# EAGLE schematic bolek (EAGLE 9.2.1)

## Sheet 1 of 10: Communication
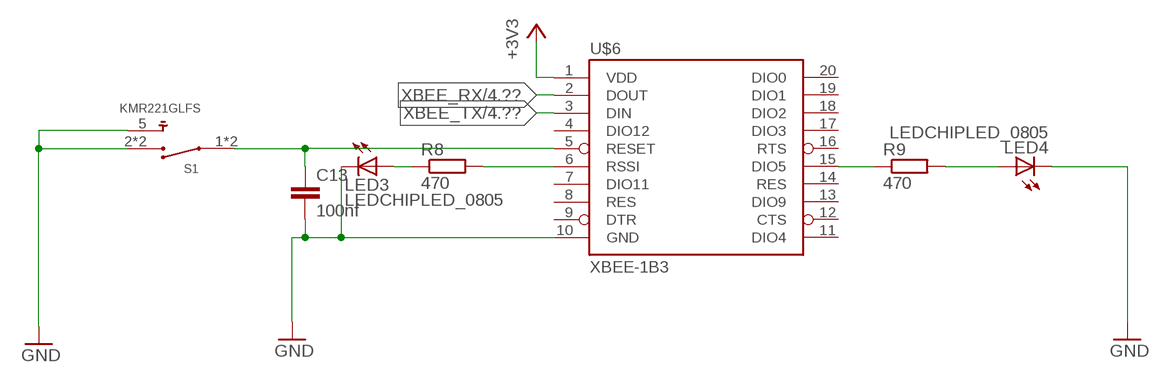
[diagram p0: schematic, sheet 1]

### Parts
C13  100nf  C-EUC0603  [C0603]
LED3  LEDCHIPLED_0805  [CHIPLED_0805]
LED4  LEDCHIPLED_0805  [CHIPLED_0805]
R8  470  R-EU_R0603  [R0603]
R9  470  R-EU_R0603  [R0603]
S1  KMR221GLFS  [SW_KMR221GLFS]
U$6  XBEE-1B3  [XBEE-SMD]

### Nets
+3V3: U$6.1(VDD) ; also sheet 2,3,4,5,6,7,8,9
GND: C13.2 LED3.C LED4.C S1.2 S1.3 S1.5 U$6.10(GND) ; also sheet 2,3,4,5,6,7,8,9
N$9: C13.1 S1.1 S1.4 U$6.5(RESET)
N$10: R8.2 U$6.6(RSSI)
N$11: LED3.A R8.1
N$12: R9.1 U$6.15(DIO5)
N$13: LED4.A R9.2
XBEE_RX: U$6.2(DOUT) ; also sheet 4
XBEE_TX: U$6.3(DIN) ; also sheet 4
Unconnected: U$6.4(DIO12) U$6.7(DIO11) U$6.8(RES) U$6.9(DTR) U$6.11(DIO4) U$6.12(CTS) U$6.13(DIO9) U$6.14(RES) U$6.16(RTS) U$6.17(DIO3) U$6.18(DIO2) U$6.19(DIO1) U$6.20(DIO0)

## Sheet 2 of 10: PLUGS
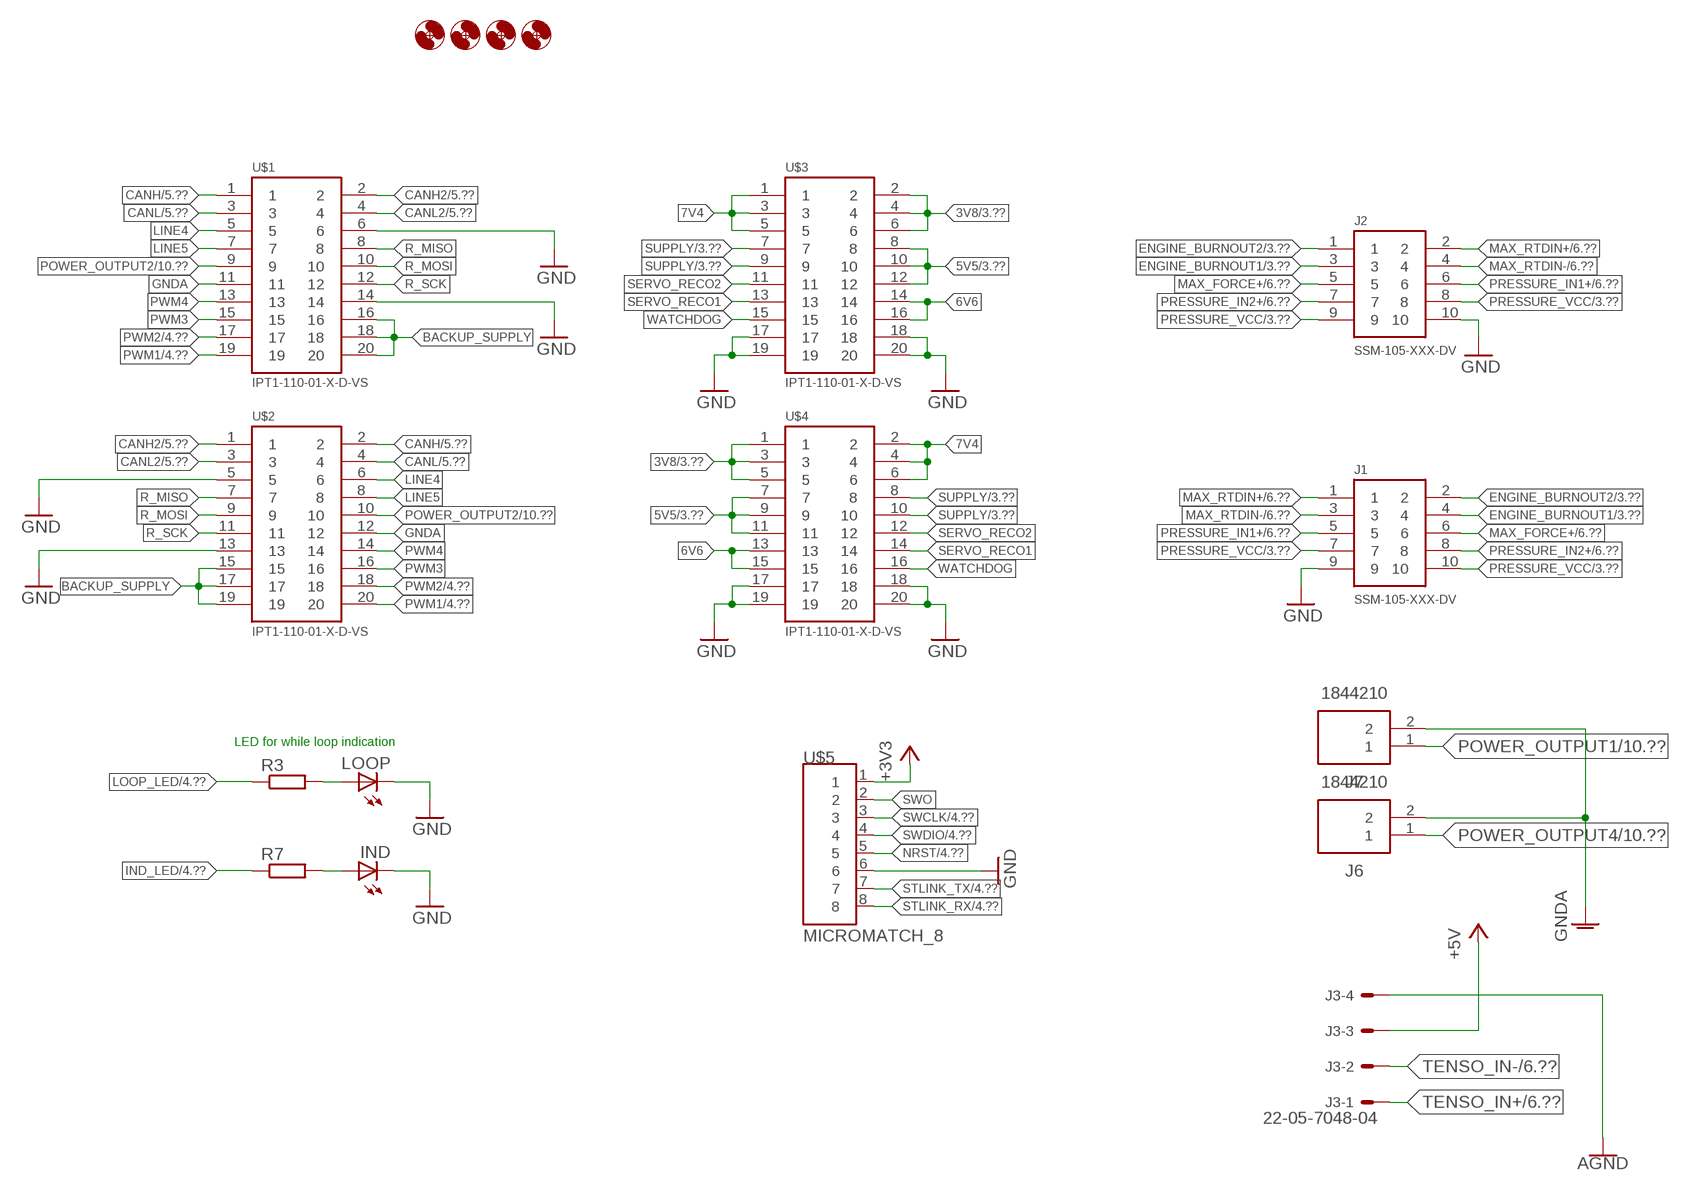
[diagram p1: schematic, sheet 2]

### Parts
H1  MOUNT-HOLE3.2  [3,2]
H2  MOUNT-HOLE3.2  [3,2]
H3  MOUNT-HOLE3.2  [3,2]
H4  MOUNT-HOLE3.2  [3,2]
IND  LEDCHIPLED_0603  [CHIPLED_0603]
J1  SSM-105-XXX-DV  [SSM-105-XXX-DV]
J2  SSM-105-XXX-DV  [SSM-105-XXX-DV]
J3  22-05-7048-04  [7395-04]
J6  1844210  [SHDR2W100P0X350_1X2_840X920X72]
J7  1844210  [SHDR2W100P0X350_1X2_840X920X72]
LOOP  LEDCHIPLED_0603  [CHIPLED_0603]
R3  R-EU_R0603  [R0603]
R7  R-EU_R0603  [R0603]
U$1  IPT1-110-01-X-D-VS  [IPT1-110-01-X-D-VS]
U$2  IPT1-110-01-X-D-VS  [IPT1-110-01-X-D-VS]
U$3  IPT1-110-01-X-D-VS  [IPT1-110-01-X-D-VS]
U$4  IPT1-110-01-X-D-VS  [IPT1-110-01-X-D-VS]
U$5  MICROMATCH_8  [MICROMATCH_8]

### Nets
3V8: U$3.2 U$3.4 U$3.6 U$4.1 U$4.3 U$4.5 ; also sheet 3
5V5: U$3.8 U$3.10 U$3.12 U$4.7 U$4.9 U$4.11 ; also sheet 3
6V6: U$3.14 U$3.16 U$4.13 U$4.15
7V4: U$3.1 U$3.3 U$3.5 U$4.2 U$4.4 U$4.6
+3V3: U$5.1 ; also sheet 1,3,4,5,6,7,8,9
+5V: J3.3 ; also sheet 3,6
AGND: J3.4 ; also sheet 6,10
BACKUP_SUPPLY: U$1.16 U$1.18 U$1.20 U$2.15 U$2.17 U$2.19
CANH: U$1.1 U$2.2 ; also sheet 5
CANH2: U$1.2 U$2.1 ; also sheet 5
CANL: U$1.3 U$2.4 ; also sheet 5
CANL2: U$1.4 U$2.3 ; also sheet 5
ENGINE_BURNOUT1: J1.4 J2.3 ; also sheet 3
ENGINE_BURNOUT2: J1.2 J2.1 ; also sheet 3
GND: IND.C J1.9 J2.10 LOOP.C U$1.6 U$1.14 U$2.5 U$2.13 U$3.17 U$3.18 U$3.19 U$3.20 U$4.17 U$4.18 U$4.19 U$4.20 U$5.6 ; also sheet 1,3,4,5,6,7,8,9
GNDA: J6.2 J7.2 U$1.11 U$2.12 ; also sheet 10
IND_LED: R7.1 ; also sheet 4
LINE4: U$1.5 U$2.6
LINE5: U$1.7 U$2.8
LOOP_LED: R3.1 ; also sheet 4
MAX_FORCE+: J1.6 J2.5 ; also sheet 6
MAX_RTDIN+: J1.1 J2.2 ; also sheet 6
MAX_RTDIN-: J1.3 J2.4 ; also sheet 6
N$2: LOOP.A R3.2
N$8: IND.A R7.2
NRST: U$5.5 ; also sheet 4
POWER_OUTPUT1: J7.1 ; also sheet 10
POWER_OUTPUT2: U$1.9 U$2.10 ; also sheet 10
POWER_OUTPUT4: J6.1 ; also sheet 10
PRESSURE_IN1+: J1.5 J2.6 ; also sheet 6
PRESSURE_IN2+: J1.8 J2.7 ; also sheet 6
PRESSURE_VCC: J1.7 J1.10 J2.8 J2.9 ; also sheet 3
PWM1: U$1.19 U$2.20 ; also sheet 4
PWM2: U$1.17 U$2.18 ; also sheet 4
PWM3: U$1.15 U$2.16
PWM4: U$1.13 U$2.14
R_MISO: U$1.8 U$2.7
R_MOSI: U$1.10 U$2.9
R_SCK: U$1.12 U$2.11
SERVO_RECO1: U$3.13 U$4.14
SERVO_RECO2: U$3.11 U$4.12
STLINK_RX: U$5.8 ; also sheet 4
STLINK_TX: U$5.7 ; also sheet 4
SUPPLY: U$3.7 U$3.9 U$4.8 U$4.10 ; also sheet 3,10
SWCLK: U$5.3 ; also sheet 4
SWDIO: U$5.4 ; also sheet 4
SWO: U$5.2
TENSO_IN+: J3.1 ; also sheet 6
TENSO_IN-: J3.2 ; also sheet 6
WATCHDOG: U$3.15 U$4.16

### Notes on the sheet
- LED for while loop indication

## Sheet 3 of 10: SUPPLY
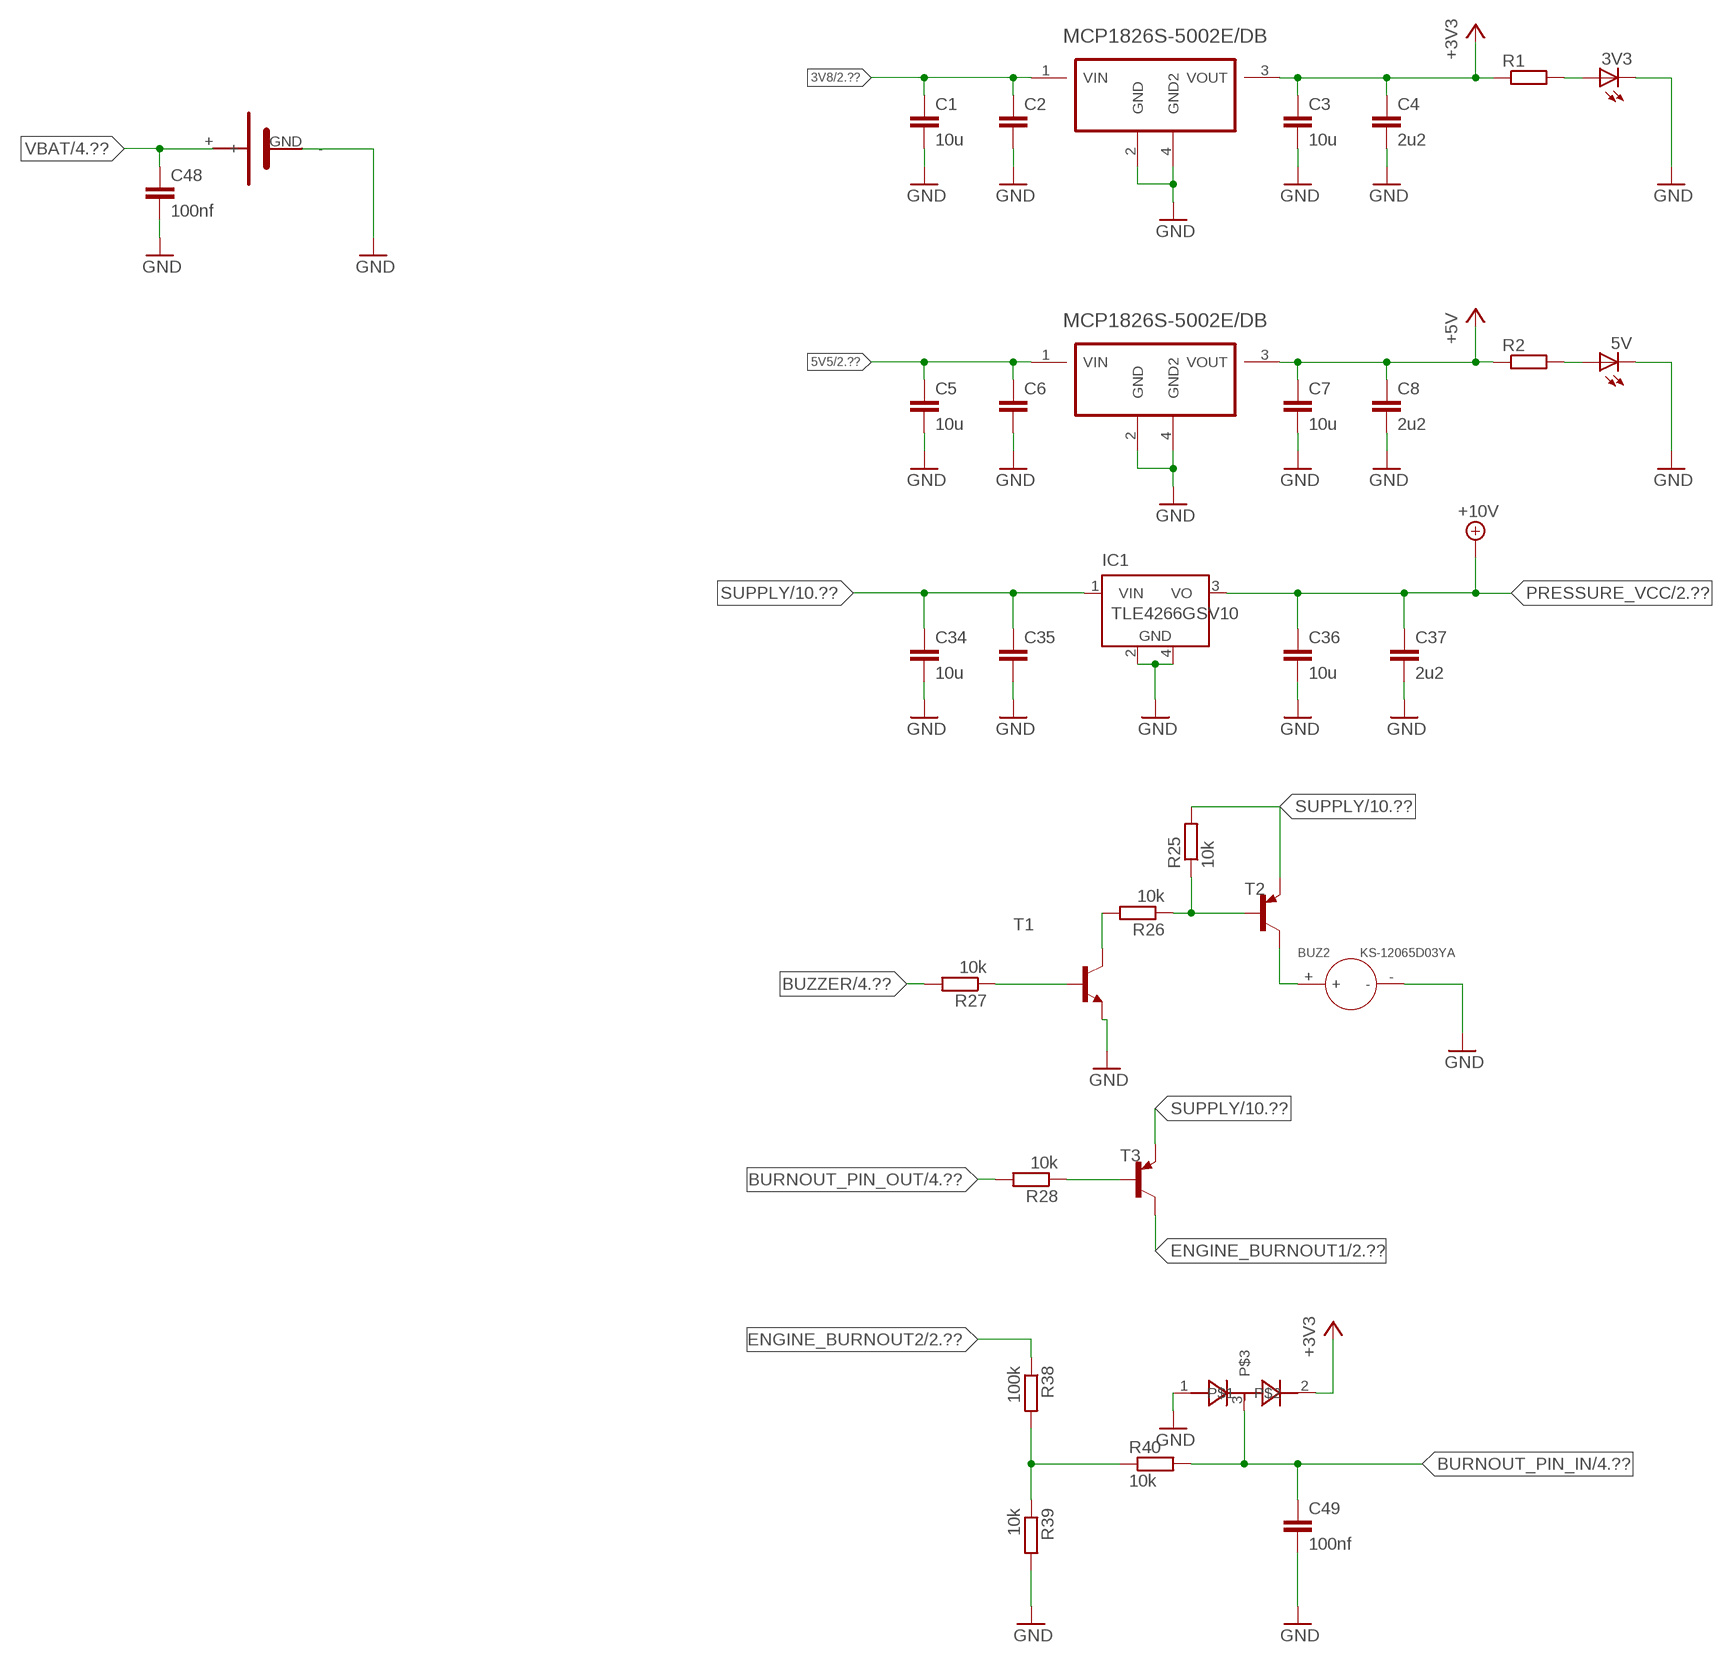
[diagram p2: schematic, sheet 3]

### Parts
3V3  LEDCHIPLED_0603  [CHIPLED_0603]
5V  LEDCHIPLED_0603  [CHIPLED_0603]
BUZ2  KS-12065D03YA  DIP-BUZZER-3V(KS-12065D03YA)  [BZ2-7.6-D12.0XH6.5MM]
C1  10u  C-EUC0805K  [C0805K]
C2  C-EUC0805K  [C0805K]
C3  10u  C-EUC0805K  [C0805K]
C4  2u2  C-EUC0805K  [C0805K]
C5  10u  C-EUC0805K  [C0805K]
C6  C-EUC0805K  [C0805K]
C7  10u  C-EUC0805K  [C0805K]
C8  2u2  C-EUC0805K  [C0805K]
C34  10u  C-EUC0805K  [C0805K]
C35  C-EUC0805K  [C0805K]
C36  10u  C-EUC0805K  [C0805K]
C37  2u2  C-EUC0805K  [C0805K]
C48  100nf  C-EUC0805K  [C0805K]
C49  100nf  C-EUC0603  [C0603]
IC1  TLE4266GSV10  LM2936MP-5.0  [SOT223]
R1  R-EU_R0603  [R0603]
R2  R-EU_R0603  [R0603]
R25  10k  R-EU_R0603  [R0603]
R26  10k  R-EU_R0603  [R0603]
R27  10k  R-EU_R0603  [R0603]
R28  10k  R-EU_R0603  [R0603]
R38  100k  R-EU_R0603  [R0603]
R39  10k  R-EU_R0603  [R0603]
R40  10k  R-EU_R0603  [R0603]
T1  BCW81-NPN-SOT23-BEC  [SOT23-BEC]
T2  BC807-16-PNP-SOT23-BEC  [SOT23-BEC]
T3  BC807-16-PNP-SOT23-BEC  [SOT23-BEC]
U1  MCP1826S-5002E/DB  [SOT230P700X180-4N]
U2  MCP1826S-5002E/DB  [SOT230P700X180-4N]
U$32  CR1220_POZ  [CR1220_POZ]
U$40  BAS40W-04  [SOT65P210X110-3N]

### Nets
3V8: C1.1 C2.1 U1.1(VIN) ; also sheet 2
5V5: C5.1 C6.1 U2.1(VIN) ; also sheet 2
+3V3: C3.1 C4.1 R1.1 U1.3(VOUT) U$40.2 ; also sheet 1,2,4,5,6,7,8,9
+5V: C7.1 C8.1 R2.1 U2.3(VOUT) ; also sheet 2,6
BURNOUT_PIN_IN: C49.1 R40.2 U$40.3 ; also sheet 4
BURNOUT_PIN_OUT: R28.2 ; also sheet 4
BUZZER: R27.2 ; also sheet 4
ENGINE_BURNOUT1: T3.C ; also sheet 2
ENGINE_BURNOUT2: R38.1 ; also sheet 2
GND: 3V3.C 5V.C BUZ2.- C1.2 C2.2 C3.2 C4.2 C5.2 C6.2 C7.2 C8.2 C34.2 C35.2 C36.2 C37.2 C48.2 C49.2 IC1.2(GND) IC1.4(GND) R39.2 T1.E U1.2(GND) U1.4(GND2) U2.2(GND) U2.4(GND2) U$32.GND(-) U$40.1 ; also sheet 1,2,4,5,6,7,8,9
N$1: 3V3.A R1.2
N$3: 5V.A R2.2
N$24: R25.1 R26.1 T2.B
N$31: BUZ2.+ T2.C
N$32: R26.2 T1.C
N$33: R27.1 T1.B
N$44: R28.1 T3.B
N$45: R38.2 R39.1 R40.1
PRESSURE_VCC: C36.1 C37.1 IC1.3(VO) ; supply symbol labelled +10V ; also sheet 2
SUPPLY: C34.1 C35.1 IC1.1(VIN) R25.2 T2.E T3.E ; also sheet 2,10
VBAT: C48.1 U$32.+ ; also sheet 4

## Sheet 4 of 10
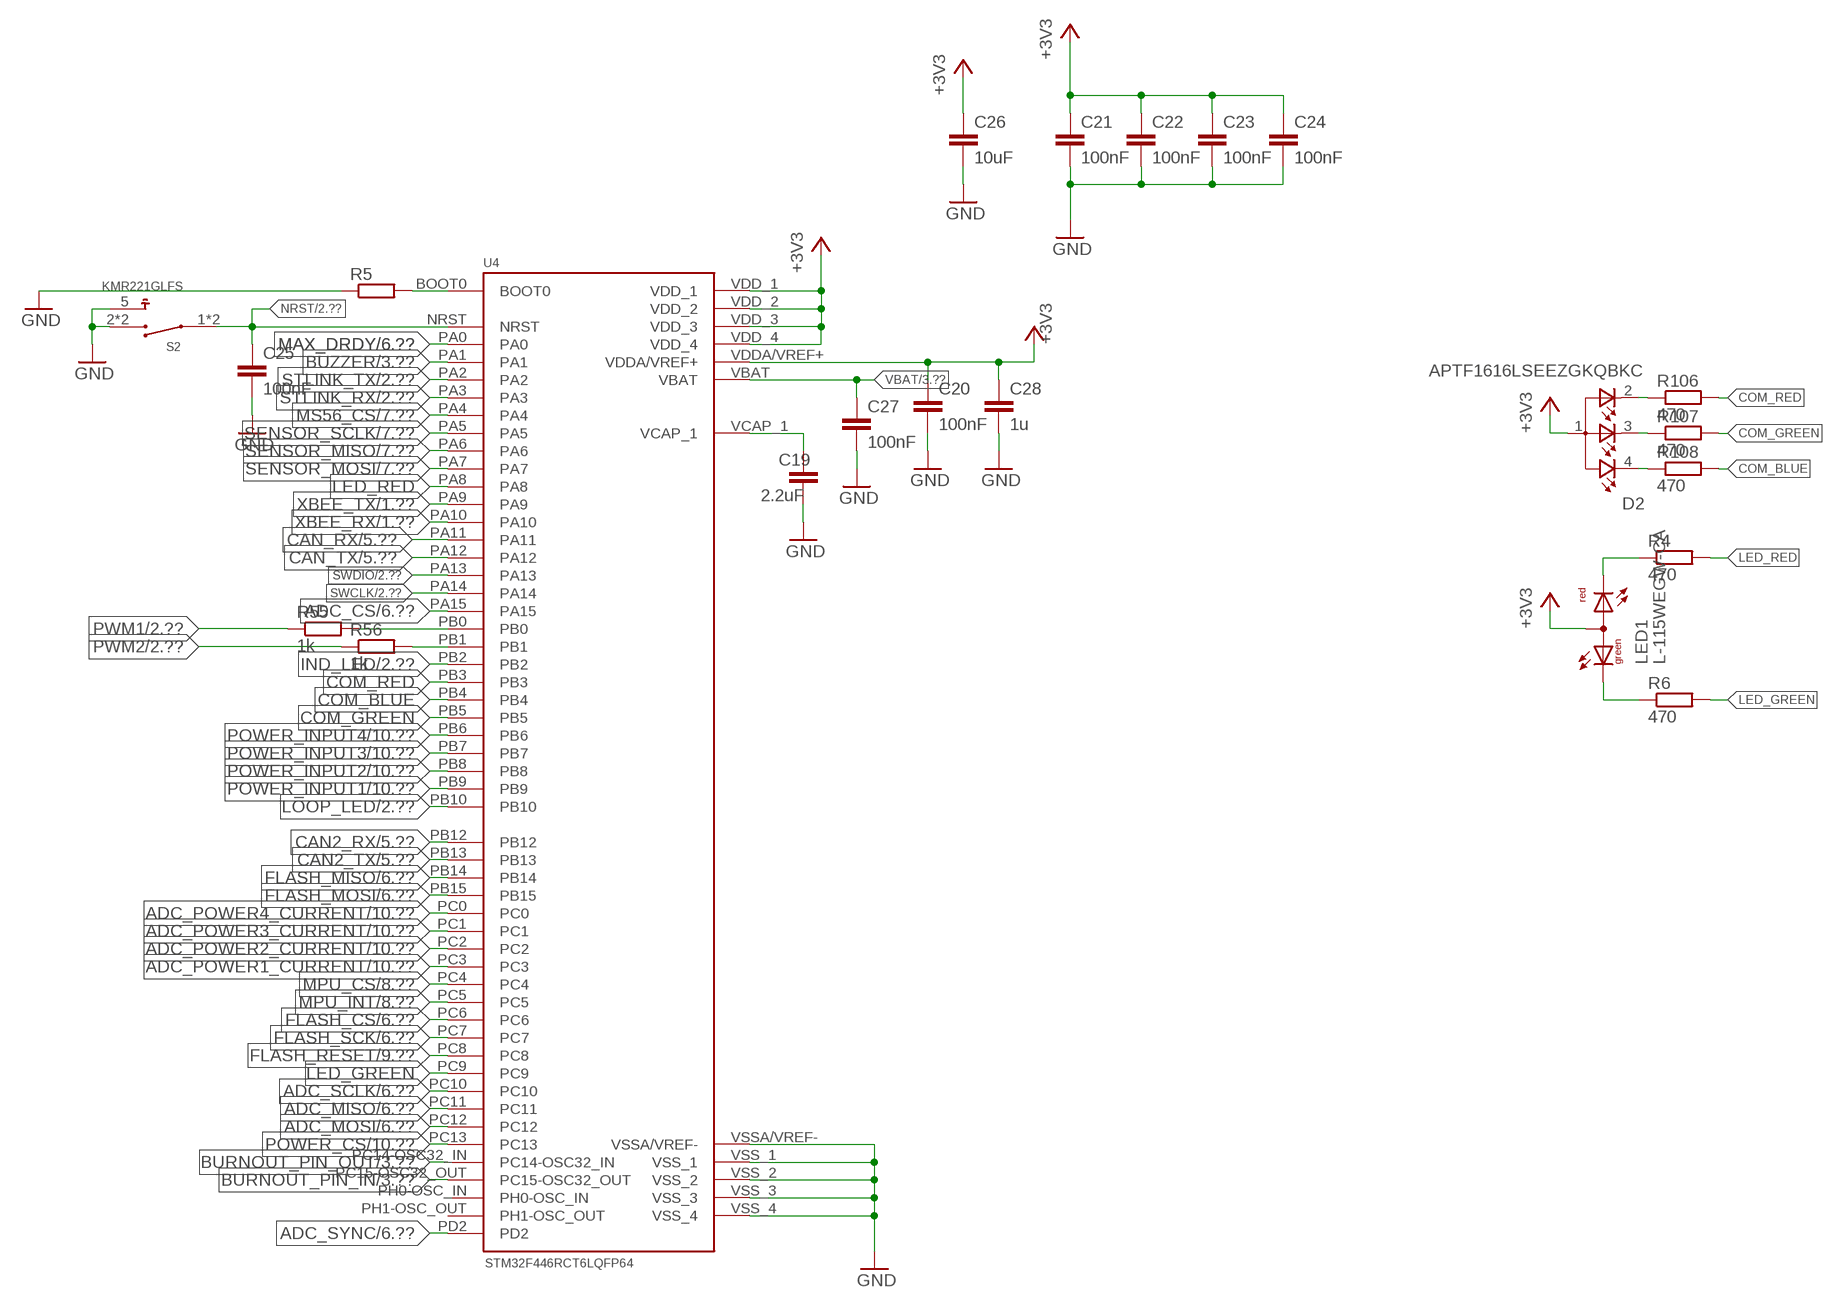
[diagram p3: schematic, sheet 4]

### Parts
C19  2.2uF  C-EUC0603K  [C0603K]
C20  100nF  C-EUC0603K  [C0603K]
C21  100nF  C-EUC0603K  [C0603K]
C22  100nF  C-EUC0603K  [C0603K]
C23  100nF  C-EUC0603K  [C0603K]
C24  100nF  C-EUC0603K  [C0603K]
C25  100nF  C-EUC0603K  [C0603K]
C26  10uF  C-EUC0805K  [C0805K]
C27  100nF  C-EUC0603K  [C0603K]
C28  1u  C-EUC0603K  [C0603K]
D2  APTF1616LSEEZGKQBKC  [LEDSC160X160X070-4N]
LED1  L-115WEGW-CA  [DUOLED-A-3MM]
R4  470  R-EU_R0603  [R0603]
R5  R-EU_R0603  [R0603]
R6  470  R-EU_R0603  [R0603]
R55  1k  R-EU_R0603  [R0603]
R56  1k  R-EU_R0603  [R0603]
R106  470  R-EU_R0603  [R0603]
R107  470  R-EU_R0603  [R0603]
R108  470  R-EU_R0603  [R0603]
S2  KMR221GLFS  [SW_KMR221GLFS]
U4  STM32F446RCT6LQFP64  [QFP50P1290X1290X120-64]

### Nets
+3V3: C20.1 C21.1 C22.1 C23.1 C24.1 C26.1 C28.1 D2.1 LED1.2(A) U4.VDD_1 U4.VDD_2 U4.VDD_3 U4.VDD_4 U4.VDDA/VREF+ ; also sheet 1,2,3,5,6,7,8,9
ADC_CS: U4.PA15 ; also sheet 6
ADC_MISO: U4.PC11 ; also sheet 6
ADC_MOSI: U4.PC12 ; also sheet 6
ADC_POWER1_CURRENT: U4.PC3 ; also sheet 10
ADC_POWER2_CURRENT: U4.PC2 ; also sheet 10
ADC_POWER3_CURRENT: U4.PC1 ; also sheet 10
ADC_POWER4_CURRENT: U4.PC0 ; also sheet 10
ADC_SCLK: U4.PC10 ; also sheet 6
ADC_SYNC: U4.PD2 ; also sheet 6
BURNOUT_PIN_IN: U4.PC15-OSC32_OUT ; also sheet 3
BURNOUT_PIN_OUT: U4.PC14-OSC32_IN ; also sheet 3
BUZZER: U4.PA1 ; also sheet 3
CAN2_RX: U4.PB12 ; also sheet 5
CAN2_TX: U4.PB13 ; also sheet 5
CAN_RX: U4.PA11 ; also sheet 5
CAN_TX: U4.PA12 ; also sheet 5
COM_BLUE: R108.2 U4.PB4
COM_GREEN: R107.2 U4.PB5
COM_RED: R106.2 U4.PB3
FLASH_CS: U4.PC6 ; also sheet 6,9
FLASH_MISO: U4.PB14 ; also sheet 6,9
FLASH_MOSI: U4.PB15 ; also sheet 6,9
FLASH_RESET: U4.PC8 ; also sheet 9
FLASH_SCK: U4.PC7 ; also sheet 6,9
GND: C19.2 C20.2 C21.2 C22.2 C23.2 C24.2 C25.2 C26.2 C27.2 C28.2 R5.1 S2.2 S2.3 S2.5 U4.VSS_1 U4.VSS_2 U4.VSS_3 U4.VSS_4 U4.VSSA/VREF- ; also sheet 1,2,3,5,6,7,8,9
IND_LED: U4.PB2 ; also sheet 2
LED_GREEN: R6.2 U4.PC9
LED_RED: R4.2 U4.PA8
LOOP_LED: U4.PB10 ; also sheet 2
MAX_DRDY: U4.PA0 ; also sheet 6
MPU_CS: U4.PC4 ; also sheet 8
MPU_INT: U4.PC5 ; also sheet 8
MS56_CS: U4.PA4 ; also sheet 7
N$4: LED1.3(CR) R4.1
N$5: R5.2 U4.BOOT0
N$6: LED1.1(CG) R6.1
N$56: R55.2 U4.PB0
N$57: R56.2 U4.PB1
N$102: D2.2 R106.1
N$103: D2.3 R107.1
N$104: D2.4 R108.1
NRST: C25.1 S2.1 S2.4 U4.NRST ; also sheet 2
POWER_CS: U4.PC13 ; also sheet 10
POWER_INPUT1: U4.PB9 ; also sheet 10
POWER_INPUT2: U4.PB8 ; also sheet 10
POWER_INPUT3: U4.PB7 ; also sheet 10
POWER_INPUT4: U4.PB6 ; also sheet 10
PWM1: R55.1 ; also sheet 2
PWM2: R56.1 ; also sheet 2
SENSOR_MISO: U4.PA6 ; also sheet 7,8
SENSOR_MOSI: U4.PA7 ; also sheet 7,8
SENSOR_SCLK: U4.PA5 ; also sheet 7,8
STLINK_RX: U4.PA3 ; also sheet 2
STLINK_TX: U4.PA2 ; also sheet 2
SWCLK: U4.PA14 ; also sheet 2
SWDIO: U4.PA13 ; also sheet 2
VBAT: C27.1 U4.VBAT ; also sheet 3
VCAP1: C19.1 U4.VCAP_1
XBEE_RX: U4.PA10 ; also sheet 1
XBEE_TX: U4.PA9 ; also sheet 1
Unconnected: U4.PH0-OSC_IN U4.PH1-OSC_OUT

## Sheet 5 of 10
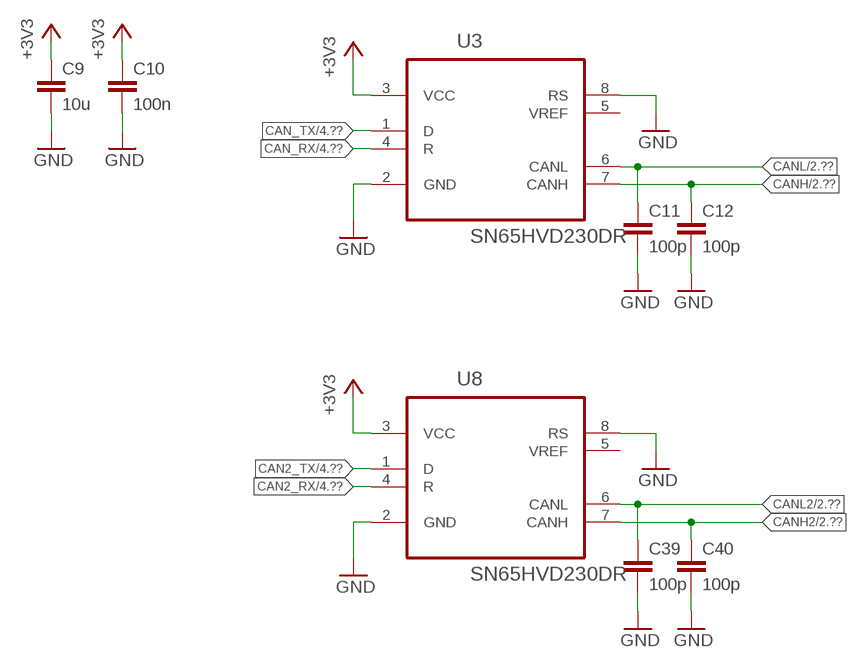
[diagram p4: schematic, sheet 5]

### Parts
C9  10u  C-EUC0805K  [C0805K]
C10  100n  C-EUC0603K  [C0603K]
C11  100p  C-EUC0603K  [C0603K]
C12  100p  C-EUC0603K  [C0603K]
C39  100p  C-EUC0603K  [C0603K]
C40  100p  C-EUC0603K  [C0603K]
U3  SN65HVD230DR  [SOIC127P600X175-8N]
U8  SN65HVD230DR  [SOIC127P600X175-8N]

### Nets
+3V3: C9.1 C10.1 U3.3(VCC) U8.3(VCC) ; also sheet 1,2,3,4,6,7,8,9
CAN2_RX: U8.4(R) ; also sheet 4
CAN2_TX: U8.1(D) ; also sheet 4
CAN_RX: U3.4(R) ; also sheet 4
CAN_TX: U3.1(D) ; also sheet 4
CANH: C12.1 U3.7(CANH) ; also sheet 2
CANH2: C40.1 U8.7(CANH) ; also sheet 2
CANL: C11.1 U3.6(CANL) ; also sheet 2
CANL2: C39.1 U8.6(CANL) ; also sheet 2
GND: C9.2 C10.2 C11.2 C12.2 C39.2 C40.2 U3.2(GND) U3.8(RS) U8.2(GND) U8.8(RS) ; also sheet 1,2,3,4,6,7,8,9
Unconnected: U3.5(VREF) U8.5(VREF)

## Sheet 6 of 10: Analog
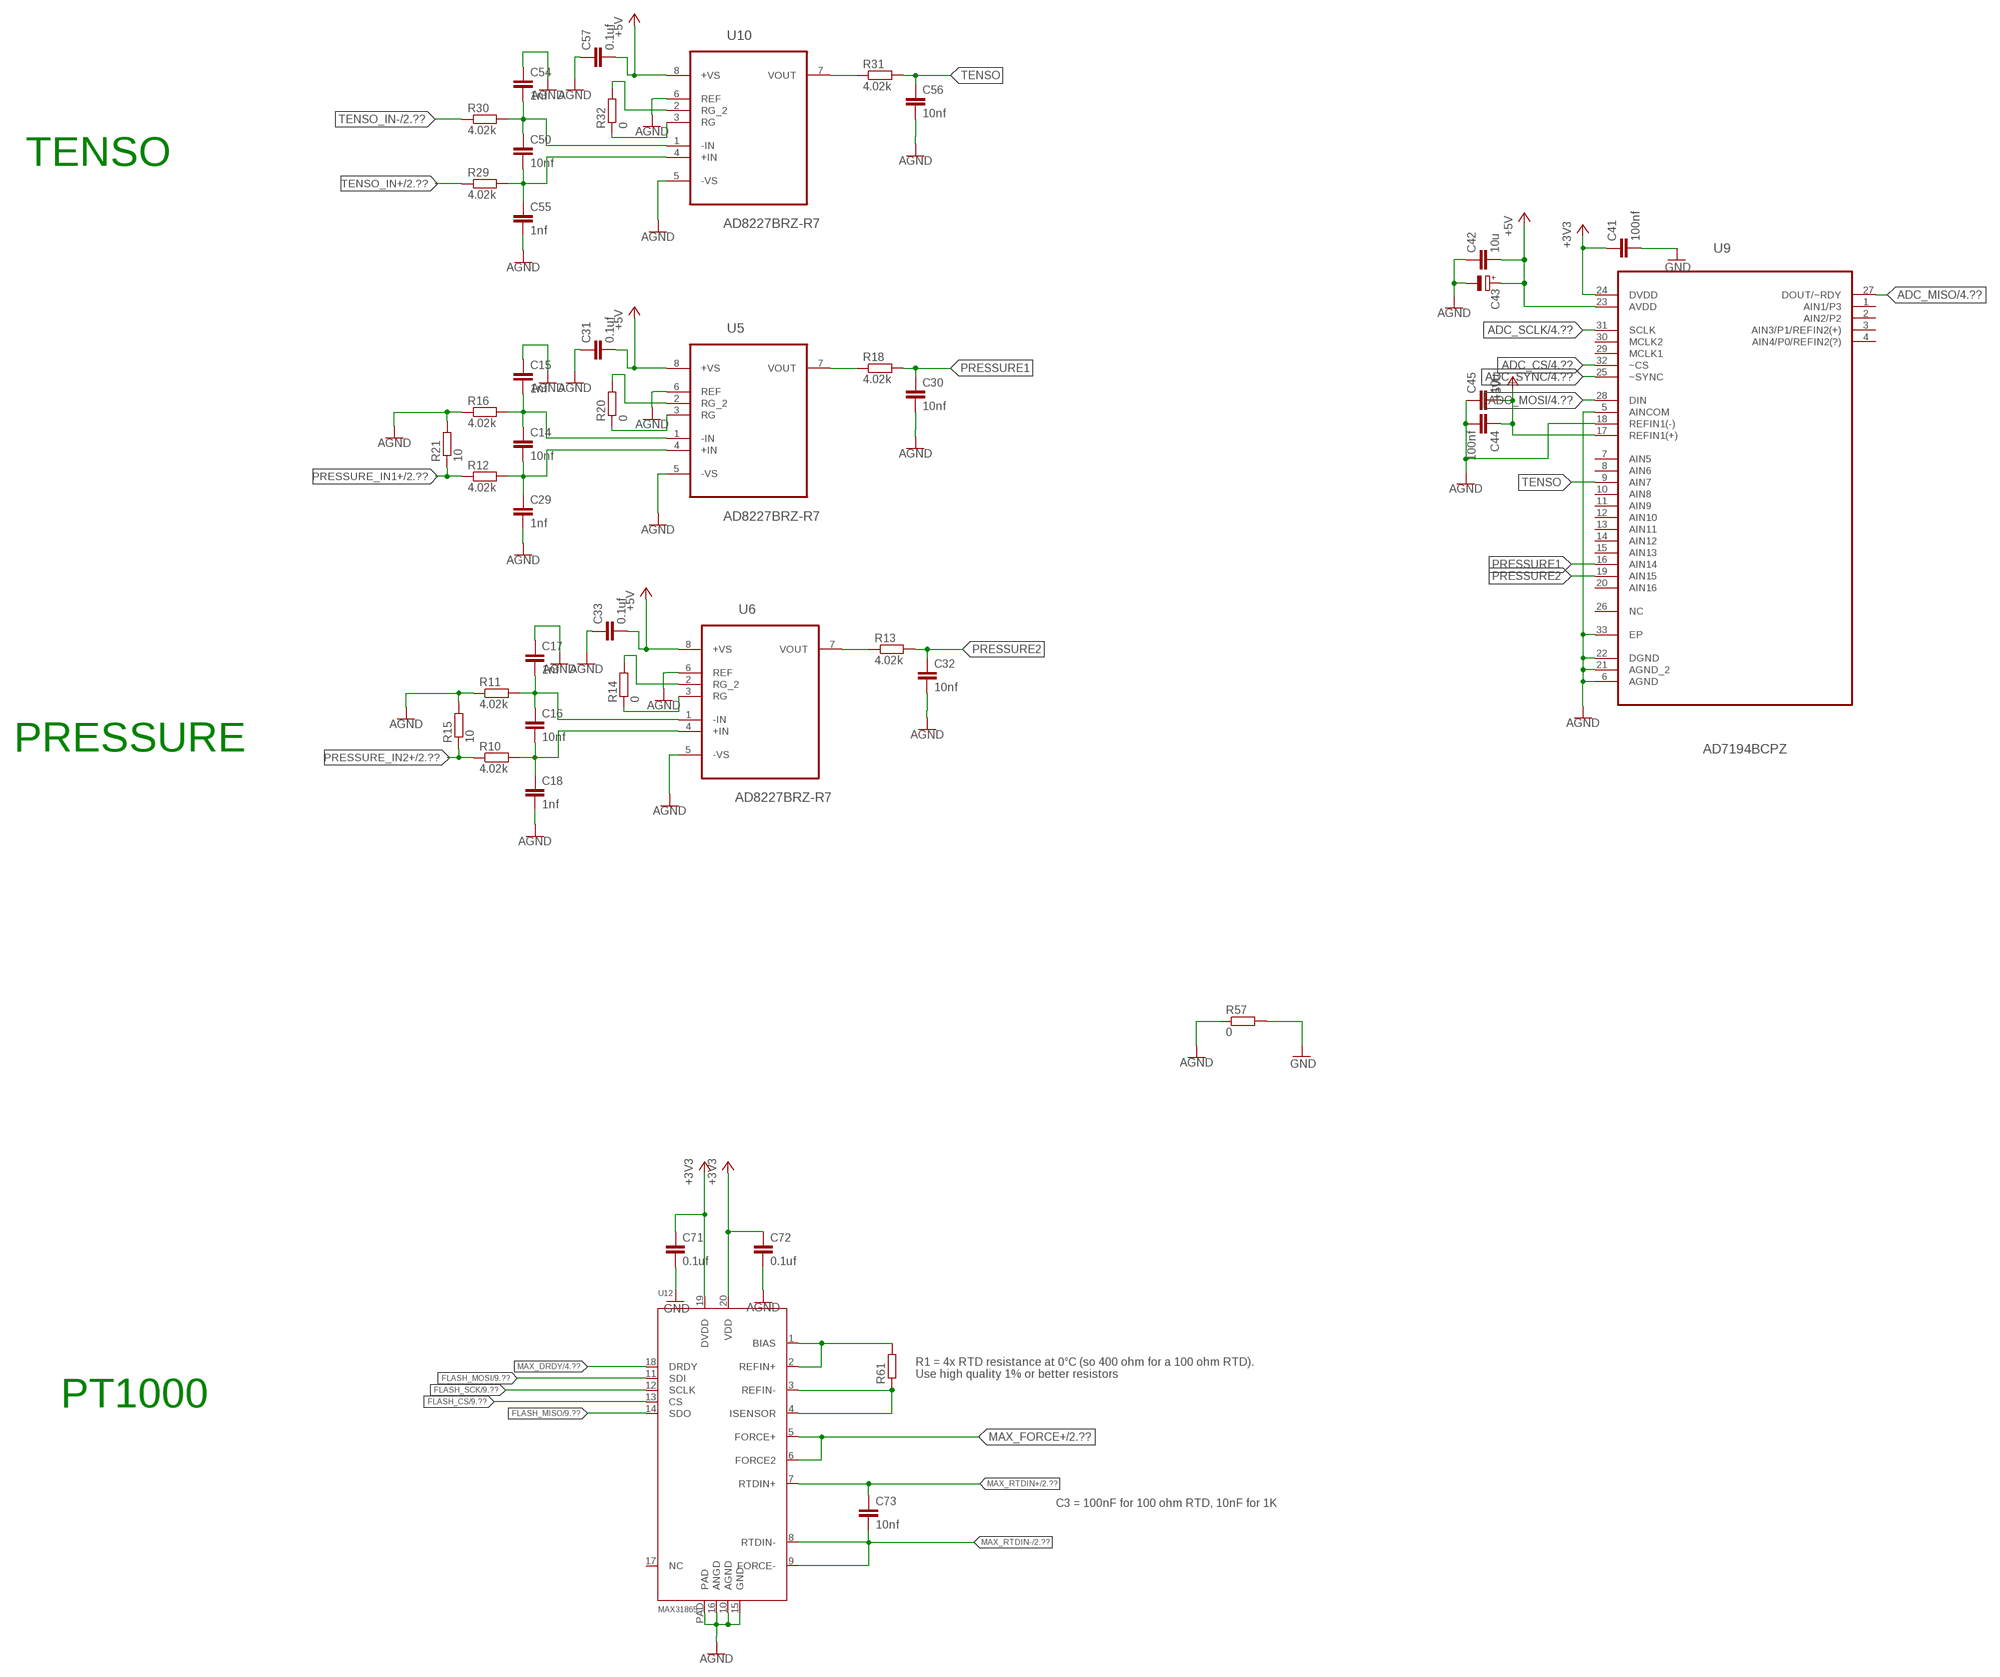
[diagram p5: schematic, sheet 6]

### Parts
C14  10nf  C-EUC0603  [C0603]
C15  1nf  C-EUC0603  [C0603]
C16  10nf  C-EUC0603  [C0603]
C17  1nf  C-EUC0603  [C0603]
C18  1nf  C-EUC0603  [C0603]
C29  1nf  C-EUC0603  [C0603]
C30  10nf  C-EUC0603  [C0603]
C31  0.1uf  C-EUC0603  [C0603]
C32  10nf  C-EUC0603  [C0603]
C33  0.1uf  C-EUC0603  [C0603]
C41  100nf  C-EUC0603K  [C0603K]
C42  10u  C-EUC0805K  [C0805K]
C43  CPOL-EUSMCA  [SMC_A]
C44  100nf  C-EUC0603K  [C0603K]
C45  10u  C-EUC0805K  [C0805K]
C50  10nf  C-EUC0603  [C0603]
C54  1nf  C-EUC0603  [C0603]
C55  1nf  C-EUC0603  [C0603]
C56  10nf  C-EUC0603  [C0603]
C57  0.1uf  C-EUC0603  [C0603]
C71  0.1uf  C-EUC0603  [C0603]
C72  0.1uf  C-EUC0603  [C0603]
C73  10nf  C-EUC0603  [C0603]
R10  4.02k  R-EU_R0603  [R0603]
R11  4.02k  R-EU_R0603  [R0603]
R12  4.02k  R-EU_R0603  [R0603]
R13  4.02k  R-EU_R0603  [R0603]
R14  0  R-EU_R0805  [R0805]
R15  10  R-EU_R0603  [R0603]
R16  4.02k  R-EU_R0603  [R0603]
R18  4.02k  R-EU_R0603  [R0603]
R20  0  R-EU_R0805  [R0805]
R21  10  R-EU_R0603  [R0603]
R29  4.02k  R-EU_R0603  [R0603]
R30  4.02k  R-EU_R0603  [R0603]
R31  4.02k  R-EU_R0603  [R0603]
R32  0  R-EU_R0805  [R0805]
R57  0  R-EU_R0603  [R0603]
R61  R-EU_R0805  [R0805]
U5  AD8227BRZ-R7  [SOIC127P600X175-8N]
U6  AD8227BRZ-R7  [SOIC127P600X175-8N]
U9  AD7194BCPZ  [QFN50P500X500X80-33N]
U10  AD8227BRZ-R7  [SOIC127P600X175-8N]
U12  MAX31865  TEMP_MAX31865  [QFN20_4MM_0.65MM]

### Nets
+3V3: C41.1 C71.1 C72.1 U9.24(DVDD) U12.19(DVDD) U12.20(VDD) ; also sheet 1,2,3,4,5,7,8,9
+5V: C31.2 C33.2 C42.2 C43.+ C44.1 C45.2 C57.2 U5.8(+VS) U6.8(+VS) U9.17(REFIN1(+)) U9.23(AVDD) U10.8(+VS) ; also sheet 2,3
ADC_CS: U9.32(~CS) ; also sheet 4
ADC_MISO: U9.27(DOUT/~RDY) ; also sheet 4
ADC_MOSI: U9.28(DIN) ; also sheet 4
ADC_SCLK: U9.31(SCLK) ; also sheet 4
ADC_SYNC: U9.25(~SYNC) ; also sheet 4
AGND: C15.1 C17.1 C18.2 C29.2 C30.2 C31.1 C32.2 C33.1 C42.1 C43.- C44.2 C45.1 C54.1 C55.2 C56.2 C57.1 C72.2 R11.1 R15.2 R16.1 R21.2 R57.1 U5.5(-VS) U5.6(REF) U6.5(-VS) U6.6(REF) U9.5(AINCOM) U9.6(AGND) U9.18(REFIN1(-)) U9.21(AGND_2) U9.22(DGND) U9.33(EP) U10.5(-VS) U10.6(REF) U12.10(AGND) U12.15(GND) U12.16(ANGD) U12.PAD ; also sheet 2,10
FLASH_CS: U12.13(CS) ; also sheet 4,9
FLASH_MISO: U12.14(SDO) ; also sheet 4,9
FLASH_MOSI: U12.11(SDI) ; also sheet 4,9
FLASH_SCK: U12.12(SCLK) ; also sheet 4,9
GND: C41.2 C71.2 R57.2 ; also sheet 1,2,3,4,5,7,8,9
MAX_DRDY: U12.18(DRDY) ; also sheet 4
MAX_FORCE+: U12.5(FORCE+) U12.6(FORCE2) ; also sheet 2
MAX_RTDIN+: C73.1 U12.7(RTDIN+) ; also sheet 2
MAX_RTDIN-: C73.2 U12.8(RTDIN-) U12.9(FORCE-) ; also sheet 2
N$14: C16.1 C17.2 R11.2 U6.1(-IN)
N$15: C16.2 C18.1 R10.2 U6.4(+IN)
N$16: R13.1 U6.7(VOUT)
N$17: R14.1 U6.3(RG)
N$18: R14.2 U6.2(RG_2)
N$21: R61.2 U12.1(BIAS) U12.2(REFIN+)
N$22: R61.1 U12.3(REFIN-) U12.4(ISENSOR)
N$25: C14.1 C15.2 R16.2 U5.1(-IN)
N$26: C14.2 C29.1 R12.2 U5.4(+IN)
N$27: R18.1 U5.7(VOUT)
N$28: R20.1 U5.3(RG)
N$29: R20.2 U5.2(RG_2)
N$30: C50.1 C54.2 R30.2 U10.1(-IN)
N$34: C50.2 C55.1 R29.2 U10.4(+IN)
N$36: R31.1 U10.7(VOUT)
N$37: R32.1 U10.3(RG)
N$38: R32.2 U10.2(RG_2)
PRESSURE1: C30.1 R18.2 U9.16(AIN14)
PRESSURE2: C32.1 R13.2 U9.19(AIN15)
PRESSURE_IN1+: R12.1 R21.1 ; also sheet 2
PRESSURE_IN2+: R10.1 R15.1 ; also sheet 2
TENSO: C56.1 R31.2 U9.9(AIN7)
TENSO_IN+: R29.1 ; also sheet 2
TENSO_IN-: R30.1 ; also sheet 2
Unconnected: U9.1(AIN1/P3) U9.2(AIN2/P2) U9.3(AIN3/P1/REFIN2(+)) U9.4(AIN4/P0/REFIN2(?)) U9.7(AIN5) U9.8(AIN6) U9.10(AIN8) U9.11(AIN9) U9.12(AIN10) U9.13(AIN11) U9.14(AIN12) U9.15(AIN13) U9.20(AIN16) U9.26(NC) U9.29(MCLK1) U9.30(MCLK2) U12.17(NC)

### Notes on the sheet
- TENSO
- PRESSURE
- R1 = 4x RTD resistance at 0°C (so 400 ohm for a 100 ohm RTD).
  Use high quality 1% or better resistors
- PT1000
- C3 = 100nF for 100 ohm RTD, 10nF for 1K

## Sheet 7 of 10: MS5607
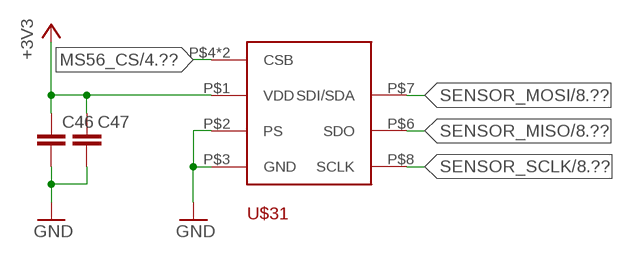
[diagram p6: schematic, sheet 7]

### Parts
C46  C-EUC0603  [C0603]
C47  C-EUC0603  [C0603]
U$31  MS56XX  [MS56XX]

### Nets
+3V3: C46.1 C47.1 U$31.P$1(VDD) ; also sheet 1,2,3,4,5,6,8,9
GND: C46.2 C47.2 U$31.P$2(PS) U$31.P$3(GND) ; also sheet 1,2,3,4,5,6,8,9
MS56_CS: U$31.P$4(CSB) U$31.P$5(CSB) ; also sheet 4
SENSOR_MISO: U$31.P$6(SDO) ; also sheet 4,8
SENSOR_MOSI: U$31.P$7(SDI/SDA) ; also sheet 4,8
SENSOR_SCLK: U$31.P$8(SCLK) ; also sheet 4,8

## Sheet 8 of 10: MPU9250
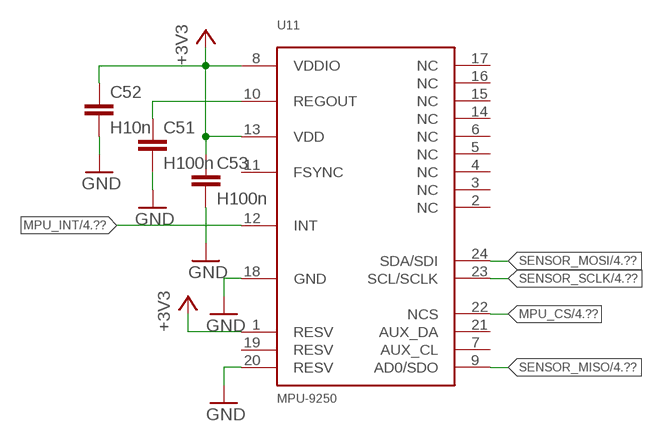
[diagram p7: schematic, sheet 8]

### Parts
C51  H100n  C-EUC0603K  [C0603K]
C52  H10n  C-EUC0603K  [C0603K]
C53  H100n  C-EUC0603K  [C0603K]
U11  MPU-9250  [MPU-9250]

### Nets
+3V3: C52.1 C53.1 U11.1(RESV) U11.8(VDDIO) U11.13(VDD) ; also sheet 1,2,3,4,5,6,7,9
GND: C51.2 C52.2 C53.2 U11.18(GND) U11.20(RESV) ; also sheet 1,2,3,4,5,6,7,9
MPU_CS: U11.22(NCS) ; also sheet 4
MPU_INT: U11.12(INT) ; also sheet 4
N$35: C51.1 U11.10(REGOUT)
SENSOR_MISO: U11.9(AD0/SDO) ; also sheet 4,7
SENSOR_MOSI: U11.24(SDA/SDI) ; also sheet 4,7
SENSOR_SCLK: U11.23(SCL/SCLK) ; also sheet 4,7
Unconnected: U11.2(NC) U11.3(NC) U11.4(NC) U11.5(NC) U11.6(NC) U11.7(AUX_CL) U11.11(FSYNC) U11.14(NC) U11.15(NC) U11.16(NC) U11.17(NC) U11.19(RESV) U11.21(AUX_DA)

## Sheet 9 of 10: Save data
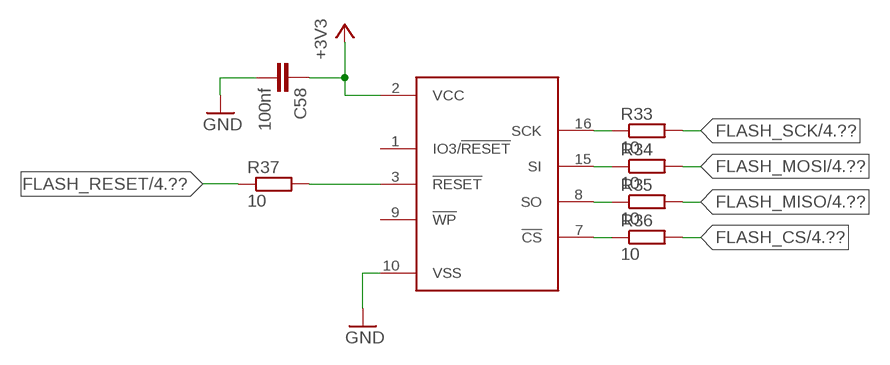
[diagram p8: schematic, sheet 9]

### Parts
C58  100nf  C-EUC0603  [C0603]
R33  10  R-EU_R0603  [R0603]
R34  10  R-EU_R0603  [R0603]
R35  10  R-EU_R0603  [R0603]
R36  10  R-EU_R0603  [R0603]
R37  10  R-EU_R0603  [R0603]
U$39  S25FLX  [SOIC16]

### Nets
+3V3: C58.1 U$39.2(VCC) ; also sheet 1,2,3,4,5,6,7,8
FLASH_CS: R36.2 ; also sheet 4,6
FLASH_MISO: R35.2 ; also sheet 4,6
FLASH_MOSI: R34.2 ; also sheet 4,6
FLASH_RESET: R37.1 ; also sheet 4
FLASH_SCK: R33.2 ; also sheet 4,6
GND: C58.2 U$39.10(VSS) ; also sheet 1,2,3,4,5,6,7,8
N$39: R33.1 U$39.16(SCK)
N$40: R34.1 U$39.15(SI)
N$41: R35.1 U$39.8(SO)
N$42: R36.1 U$39.7(!CS)
N$43: R37.2 U$39.3(!RESET)
Unconnected: U$39.1(IO3/!RESET) U$39.9(!WP)

## Sheet 10 of 10: POWER OUTPUT
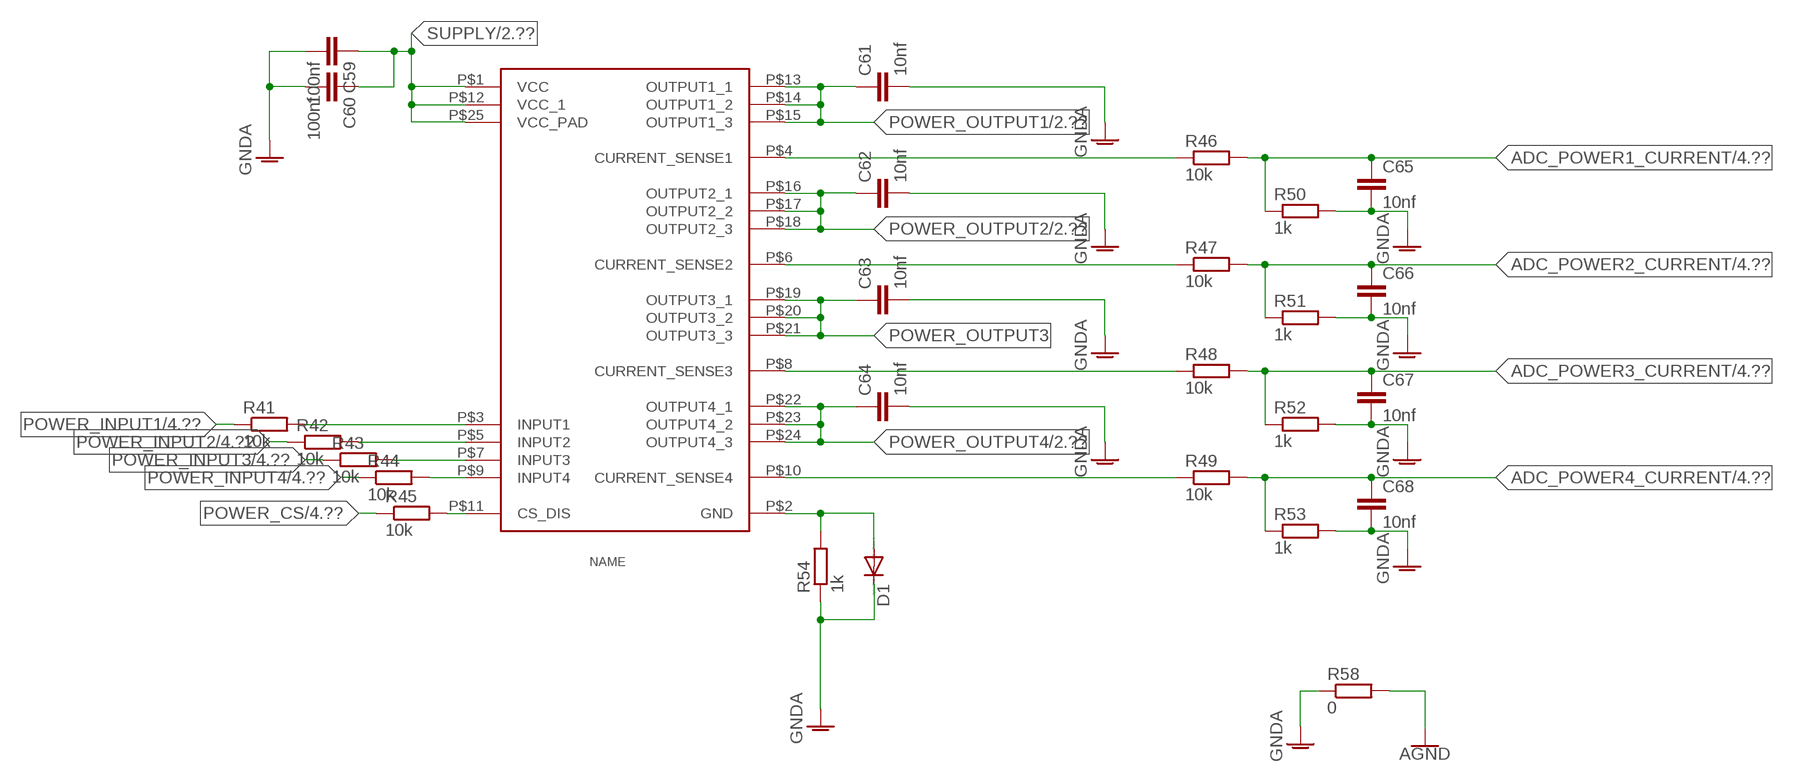
[diagram p9: schematic, sheet 10]

### Parts
C59  100nf  C-EUC0603  [C0603]
C60  100nf  C-EUC0603  [C0603]
C61  10nf  C-EUC0603  [C0603]
C62  10nf  C-EUC0603  [C0603]
C63  10nf  C-EUC0603  [C0603]
C64  10nf  C-EUC0603  [C0603]
C65  10nf  C-EUC0603  [C0603]
C66  10nf  C-EUC0603  [C0603]
C67  10nf  C-EUC0603  [C0603]
C68  10nf  C-EUC0603  [C0603]
D1  DIODE-SOD123  [SOD123]
R41  10k  R-EU_R0603  [R0603]
R42  10k  R-EU_R0603  [R0603]
R43  10k  R-EU_R0603  [R0603]
R44  10k  R-EU_R0603  [R0603]
R45  10k  R-EU_R0603  [R0603]
R46  10k  R-EU_R0603  [R0603]
R47  10k  R-EU_R0603  [R0603]
R48  10k  R-EU_R0603  [R0603]
R49  10k  R-EU_R0603  [R0603]
R50  1k  R-EU_R0603  [R0603]
R51  1k  R-EU_R0603  [R0603]
R52  1k  R-EU_R0603  [R0603]
R53  1k  R-EU_R0603  [R0603]
R54  1k  R-EU_R0603  [R0603]
R58  0  R-EU_R0603  [R0603]
VNQ5027AK-E1  VNQ5027AK-E  [POWERSSO-24]

### Nets
ADC_POWER1_CURRENT: C65.1 R46.2 R50.1 ; also sheet 4
ADC_POWER2_CURRENT: C66.1 R47.2 R51.1 ; also sheet 4
ADC_POWER3_CURRENT: C67.1 R48.2 R52.1 ; also sheet 4
ADC_POWER4_CURRENT: C68.1 R49.2 R53.1 ; also sheet 4
AGND: R58.2 ; also sheet 2,6
GNDA: C59.2 C60.2 C61.2 C62.2 C63.2 C64.2 C65.2 C66.2 C67.2 C68.2 D1.C R50.2 R51.2 R52.2 R53.2 R54.1 R58.1 ; also sheet 2
N$46: R46.1 VNQ5027AK-E1.P$4(CURRENT_SENSE1)
N$47: R47.1 VNQ5027AK-E1.P$6(CURRENT_SENSE2)
N$48: R48.1 VNQ5027AK-E1.P$8(CURRENT_SENSE3)
N$49: R49.1 VNQ5027AK-E1.P$10(CURRENT_SENSE4)
N$50: R41.2 VNQ5027AK-E1.P$3(INPUT1)
N$51: R42.2 VNQ5027AK-E1.P$5(INPUT2)
N$52: R43.2 VNQ5027AK-E1.P$7(INPUT3)
N$53: R44.2 VNQ5027AK-E1.P$9(INPUT4)
N$54: R45.2 VNQ5027AK-E1.P$11(CS_DIS)
N$55: D1.A R54.2 VNQ5027AK-E1.P$2(GND)
POWER_CS: R45.1 ; also sheet 4
POWER_INPUT1: R41.1 ; also sheet 4
POWER_INPUT2: R42.1 ; also sheet 4
POWER_INPUT3: R43.1 ; also sheet 4
POWER_INPUT4: R44.1 ; also sheet 4
POWER_OUTPUT1: C61.1 VNQ5027AK-E1.P$13(OUTPUT1_1) VNQ5027AK-E1.P$14(OUTPUT1_2) VNQ5027AK-E1.P$15(OUTPUT1_3) ; also sheet 2
POWER_OUTPUT2: C62.1 VNQ5027AK-E1.P$16(OUTPUT2_1) VNQ5027AK-E1.P$17(OUTPUT2_2) VNQ5027AK-E1.P$18(OUTPUT2_3) ; also sheet 2
POWER_OUTPUT3: C63.1 VNQ5027AK-E1.P$19(OUTPUT3_1) VNQ5027AK-E1.P$20(OUTPUT3_2) VNQ5027AK-E1.P$21(OUTPUT3_3)
POWER_OUTPUT4: C64.1 VNQ5027AK-E1.P$22(OUTPUT4_1) VNQ5027AK-E1.P$23(OUTPUT4_2) VNQ5027AK-E1.P$24(OUTPUT4_3) ; also sheet 2
SUPPLY: C59.1 C60.1 VNQ5027AK-E1.P$1(VCC) VNQ5027AK-E1.P$12(VCC_1) VNQ5027AK-E1.P$25(VCC_PAD) ; also sheet 2,3

## Library data of the parts
3V3 5V IND LOOP = adafruit:LED: LED OSRAM: - CHIPLED LG R971, LG N971, LY N971, LG Q971, LY Q971, LO R971, LY R971 LH N974, LH R974 LS Q976, LO Q976, LY Q976 LO Q996 - Hyper CHIPLED LW Q18S LB Q993, LB Q99A, LB R99A - SideLED LS A670, LO A670, LY A670, LG A670, LP A670 LB A673, LV A673, LT A673, LW A673 LH A674 LY A675 LS A676, LA A676, LO A676, LY A676, LW A676 LS A679, LY A679, LG A679 - Hyper Micro SIDELED® LS Y876, LA Y876, LO Y876, LY Y876 LT Y87S - SmartLED LW L88C, LW L88S LB L89C, LB L89S, LG L890 LS L89K, LO L89K, LY L89K LS L896, LA L896, LO L896, LY L896 - TOPLED LS T670, LO T670, LY T670, LG T670, LP T670 LSG T670, LSP T670, LSY T670, LOP T670, LYG T670 LG T671, LOG T671, LSG T671 LB T673, LV T673, LT T673, LW T673 LH T674 LS T676, LA T676, LO T676, LY T676, LB T676, LH T676, LSB T676, LW T676 LB T67C, LV T67C, LT T67C, LS T67K, LO T67K, LY T67K, LW E67C LS E67B, LA E67B, LO E67B, LY E67B, LB E67C, LV E67C, LT E67C LW T67C LS T679, LY T679, LG T679 LS T770, LO T770, LY T770, LG T770, LP T770 LB T773, LV T773, LT T773, LW T773 LH T774 LS E675, LA E675, LY E675, LS T675 LS T776, LA T776, LO T776, LY T776, LB T776 LHGB T686 LT T68C, LB T68C - Hyper Mini TOPLED® LB M676 - Mini TOPLED Santana® LG M470 LS M47K, LO M47K, LY M47K Source: http://www.osram.convergy.de/
BUZ2 = Seeed-Connector:DIP-BUZZER-3V(KS-12065D03YA): 312010004; MPN: KS-12065D03YA
C1-C13 C19-C28 C34-C37 C39-C42 C44-C49 C51-C53 C58-C68 C71-C73 = rcl:C-EU: CAPACITOR, European symbol; SPICEPREFIX: C
C14-C18 C29-C33 C50 C54-C57 = rcl:C-EU: CAPACITOR, European symbol
C43 = resistor:CPOL-EU: POLARIZED CAPACITOR, European symbol
D1 = diode:DIODE-: DIODE
D2 = KINGBRIGHT1616:APTF1616LSEEZGKQBKC: HELI Colour; 1.6X1.6MM LOW CURRENT RGB SMD LED; AVAILABILITY: Unavailable; DESCRIPTION: LED RGB 621NM 525NM 465NM 0606; MF: Kingbright; MP: APTF1616LSEEZGKQBKC; PACKAGE: 0606 Kingbright; PRICE: 0.47 USD
H1-H4 = holes:MOUNT-HOLE: MOUNTING HOLE with drill center marker
IC1 = national-semiconductor:LM2936MP?*: Ultra-Low Quiescent Current LDO Voltage Regulator Source: Data sheet <http://www.national.com/ds/LM/LM2936.pdf>; MF: NATIONAL SEMICONDUCTOR; MPN: LM2936MP-5.0/NOPB; OC_FARNELL: 1469063; OC_NEWARK: 41K4524
J1 J2 = SMD_254_10:SSM-105-XXX-DV: .100" TIGER BEAM SOCKET ASAEMBLY.; AVAILABILITY: Unavailable; DESCRIPTION: .100 _2.54 mm_ Tiger Claw™ Surface Mount Socket Strip 10 positions; MF: Samtec; MP: SSM-105-XXX-DV; PACKAGE: None; PRICE: None
J3 = con-molex:22-?-04: CONNECTOR wire to board 2.54 mm (.1 inch) pitch header; MF: MOLEX; OC_FARNELL: unknown; OC_NEWARK: unknown
J6 J7 = Phoenix_3.5 (1):1844210: Pluggable Terminal Blocks 2 Pos 3.5mm pitch Through Hole Header <https://componentsearchengine.com/Images/1/1844210.jpg> Source: Datasheet <https://www.phoenixcontact.com/online/portal/us?uri=pxc-oc-itemdetail:pid=1844210>; DESCRIPTION: Pluggable Terminal Blocks 2 Pos 3.5mm pitch Through Hole Header; HEIGHT: 7.25mm; MANUFACTURER_NAME: Phoenix Contact; MANUFACTURER_PART_NUMBER: 1844210; RS_PART_NUMBER: 8042248; SUPPLIER_NAME: RS
LED1 = led:L-115WEGW-CA: T-1(3mm) BI-COLOR INDICATOR LAMP Source: Kingbright .. 2_colour_led_.pdf
LED3 LED4 = audio amplifier example:LED
R1-R7 R25-R28 R33-R58 R61 R106-R108 = rcl:R-EU_: RESISTOR, European symbol; SPICEPREFIX: R
R8 R9 = resistor:R-EU_: RESISTOR, European symbol
R10-R16 R18 R20 R21 R29-R32 = rcl:R-EU_: RESISTOR, European symbol
S1 S2 = KMR221GLFS:KMR221GLFS: Switch Tactile N.O. SPST Button Gull Wing 0.05A 32VDC 1VA 200000Cycles 2N SMD Automotive T/R; AVAILABILITY: Good; DESCRIPTION: Switch Tactile N.O. SPST Button Gull Wing 0.05A 32VDC 1VA 200000Cycles 2N SMD Automotive T/R; MF: C&K Components; MP: KMR221GLFS; PACKAGE: None; PRICE: 0.28 USD
T1 = DC_LOAD_AU:*-NPN-: NPN Transistror BF959 corrected 2008.03.06
T2 T3 = DC_LOAD_AU:*-PNP-: PNP Transistror
U1 U2 = MCP1826S-5002E_DB:MCP1826S-5002E/DB: IC, LDO, 5V, 1A; AVAILABILITY: Unavailable; DESCRIPTION: MCP1826S Series 1 A 5 V Fixed Output Surface Mount LDO Regulator - SOT-223; MF: Microchip; MP: MCP1826S-5002E/DB; PACKAGE: SOT-223-3 Microchip; PRICE: None
U3 U8 = SN65HVD230DR:SN65HVD230DR: 3.3-V CAN TRANSCEIVERS; AVAILABILITY: Good; DESCRIPTION: 3.3V CAN Transceiver with Standby Mode 8-SOIC -40 to 85; MF: Texas Instruments; MP: SN65HVD230DR; PACKAGE: SOIC-8 Texas Instruments; PRICE: 1.59 USD
U4 = STM32F446RCT6:STM32F446RCT6: 32 Bit Microcontroller, High Performance, ARM Cortex-M4, 180 MHz, 256 KB, 128 KB, 64, LQFP
U5 U6 U10 = Analog Devices_By_element14_Batch_1:AD8227BRZ-R7: Wide Supply Range, Rail-to-Rail Output Instrumentation Amplifier; MPN: AD8227BRZ-R7; OC_FARNELL: -; OC_NEWARK: 14R8723; PACKAGE: SOIC-8; SUPPLIER: Analog Devices
U9 = AD7194:AD7194BCPZ: 8-Channel, 4.8 kHz, Ultralow Noise, 24-Bit Sigma-Delta ADC with PGA; MPN: AD7194BCPZ; OC_FARNELL: 1827288; OC_NEWARK: 58R3898; PACKAGE: QFN-32; SUPPLIER: Analog Devices
U11 = MPU-9250:MPU-9250: 314990005; AVAILABILITY: Good; DESCRIPTION: SMD Gyroscope/Accelerometer/Magnetometer Sensor; 9-AXIS; MF: InvenSense; MP: MPU-9250; PACKAGE: QFN-24 InvenSense; PRICE: 6.45 USD
U12 = microbuilder:TEMP_MAX31865: MAX31865 - Resistance to Digital Convertor for Platinum Resistance Temperature Detectors (RTDs) Handles 100 ohm - 1K ohm (at 0°C) platinum RTDs. 15-bit ADC resolution (nominally 0.03125°C), 0.5°C accuracy.
U$1-U$4 = smd_2.54_20pos:IPT1-110-01-X-D-VS: .100 DOUBLE ROW SHROUDED TERMINAL ASSEMBLY.; AVAILABILITY: Unavailable; DESCRIPTION: Conn Isolated Power Terminal Strip HDR 20 POS 2.54mm Solder ST SMD 20 Terminal 1 Port Tube; MF: Samtec; MP: IPT1-110--01-S-D-VS-; PACKAGE: None; PRICE: None
U$5 = Micromatch:MICROMATCH_8
U$6 = SparkFun:XBEE-1
U$31 = MS56XX:MS56XX
U$32 = SS_coin:CR1220_POZ
U$39 = s25FL:S25FLX
U$40 = BAS40w-0:BAS40W-04
VNQ5027AK-E1 = VNQ5027AK-E:VNQ5027AK-E